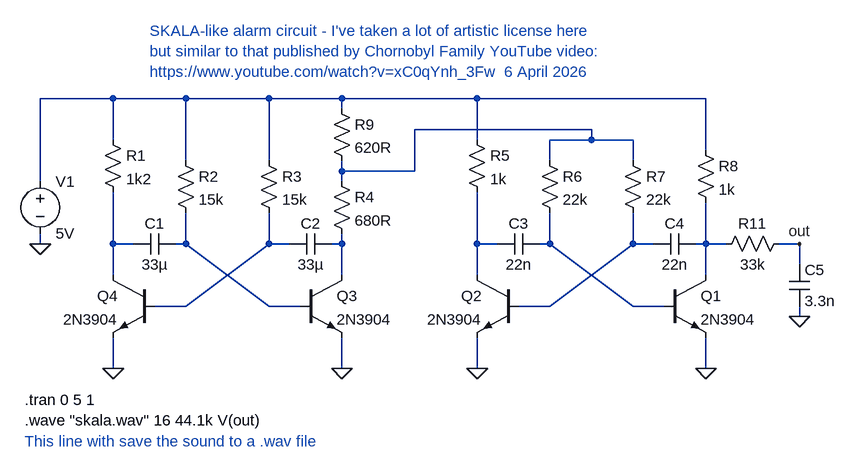
[diagram p0: schematic skala.asc]
skala.asc, the LTspice schematic file:
Version 4.1
SHEET 1 1672 680
WIRE 112 -160 0 -160
WIRE 224 -160 112 -160
WIRE 352 -160 224 -160
WIRE 464 -160 352 -160
WIRE 672 -160 464 -160
WIRE 1024 -160 672 -160
WIRE 464 -144 464 -160
WIRE 848 -112 576 -112
WIRE 112 -96 112 -160
WIRE 672 -96 672 -160
WIRE 848 -96 848 -112
WIRE 848 -96 784 -96
WIRE 912 -96 848 -96
WIRE 1024 -80 1024 -160
WIRE 224 -64 224 -160
WIRE 352 -64 352 -160
WIRE 784 -64 784 -96
WIRE 912 -64 912 -96
WIRE 464 -48 464 -64
WIRE 576 -48 576 -112
WIRE 576 -48 464 -48
WIRE 0 -32 0 -160
WIRE 464 -32 464 -48
WIRE 0 64 0 48
WIRE 112 64 112 -16
WIRE 144 64 112 64
WIRE 224 64 224 16
WIRE 224 64 208 64
WIRE 352 64 352 16
WIRE 384 64 352 64
WIRE 464 64 464 48
WIRE 464 64 448 64
WIRE 672 64 672 -16
WIRE 704 64 672 64
WIRE 784 64 784 16
WIRE 784 64 768 64
WIRE 912 64 912 16
WIRE 944 64 912 64
WIRE 1024 64 1024 0
WIRE 1024 64 1008 64
WIRE 1056 64 1024 64
WIRE 1168 64 1136 64
WIRE 1168 96 1168 64
WIRE 112 112 112 64
WIRE 464 112 464 64
WIRE 672 112 672 64
WIRE 1024 112 1024 64
WIRE 224 160 352 64
WIRE 224 160 176 160
WIRE 352 160 224 64
WIRE 400 160 352 160
WIRE 784 160 912 64
WIRE 784 160 736 160
WIRE 912 160 784 64
WIRE 960 160 912 160
WIRE 1168 176 1168 160
WIRE 112 256 112 208
WIRE 464 256 464 208
WIRE 672 256 672 208
WIRE 1024 256 1024 208
FLAG 112 256 0
FLAG 464 256 0
FLAG 0 64 0
FLAG 1168 64 out
FLAG 672 256 0
FLAG 1168 176 0
FLAG 1024 256 0
SYMBOL res 96 -112 R0
SYMATTR InstName R1
SYMATTR Value 1k2
SYMBOL res 208 -80 R0
SYMATTR InstName R2
SYMATTR Value 15k
SYMBOL res 336 -80 R0
SYMATTR InstName R3
SYMATTR Value 15k
SYMBOL res 448 -48 R0
SYMATTR InstName R4
SYMATTR Value 680R
SYMBOL cap 208 48 R90
WINDOW 0 0 32 VBottom 2
WINDOW 3 32 32 VTop 2
SYMATTR InstName C1
SYMATTR Value 33µ
SYMBOL cap 448 48 R90
WINDOW 0 0 32 VBottom 2
WINDOW 3 32 32 VTop 2
SYMATTR InstName C2
SYMATTR Value 33µ
SYMBOL voltage 0 -48 R0
WINDOW 123 0 0 Left 0
WINDOW 39 0 0 Left 0
SYMATTR InstName V1
SYMATTR Value 5V
SYMBOL npn 400 112 R0
SYMATTR InstName Q3
SYMATTR Value 2N3904
SYMBOL npn 176 112 M0
SYMATTR InstName Q4
SYMATTR Value 2N3904
SYMBOL res 656 -112 R0
SYMATTR InstName R5
SYMATTR Value 1k
SYMBOL res 768 -80 R0
SYMATTR InstName R6
SYMATTR Value 22k
SYMBOL res 896 -80 R0
SYMATTR InstName R7
SYMATTR Value 22k
SYMBOL res 1008 -96 R0
SYMATTR InstName R8
SYMATTR Value 1k
SYMBOL cap 768 48 R90
WINDOW 0 0 32 VBottom 2
WINDOW 3 32 32 VTop 2
SYMATTR InstName C3
SYMATTR Value 22n
SYMBOL cap 1008 48 R90
WINDOW 0 0 32 VBottom 2
WINDOW 3 32 32 VTop 2
SYMATTR InstName C4
SYMATTR Value 22n
SYMBOL npn 960 112 R0
SYMATTR InstName Q1
SYMATTR Value 2N3904
SYMBOL npn 736 112 M0
SYMATTR InstName Q2
SYMATTR Value 2N3904
SYMBOL res 448 -160 R0
SYMATTR InstName R9
SYMATTR Value 620R
SYMBOL res 1152 48 R90
WINDOW 0 0 56 VBottom 2
WINDOW 3 32 56 VTop 2
SYMATTR InstName R11
SYMATTR Value 33k
SYMBOL cap 1152 96 R0
SYMATTR InstName C5
SYMATTR Value 3.3n
TEXT -24 304 Left 2 !.tran 0 5 1
TEXT -24 336 Left 2 !.wave "skala.wav" 16 44.1k V(out)
TEXT 168 -264 Left 2 ;SKALA-like alarm circuit - I've taken a lot of artistic license here\nbut similar to that published by Chornobyl Family YouTube video:\nhttps://www.youtube.com/watch?v=xC0qYnh_3Fw  6 April 2026
TEXT -24 368 Left 2 ;This line with save the sound to a .wav file

The netlist it stands for:
* skala.asc
R1 N001 N003 1k2
R2 N001 N004 15k
R3 N001 N005 15k
R4 N002 N006 680R
C1 N004 N003 33µ
C2 N006 N005 33µ
V1 N001 0 5V
Q3 N006 N004 0 0 2N3904
Q4 N003 N005 0 0 2N3904
R5 N001 N007 1k
R6 N002 N008 22k
R7 N002 N009 22k
R8 N001 N010 1k
C3 N008 N007 22n
C4 N010 N009 22n
Q1 N010 N008 0 0 2N3904
Q2 N007 N009 0 0 2N3904
R9 N001 N002 620R
R11 out N010 33k
C5 out 0 3.3n
.model NPN NPN
.model PNP PNP
.lib standard.bjt
.tran 0 5 1
.wave "skala.wav" 16 44.1k V(out)
* SKALA-like alarm circuit - I've taken a lot of artistic license here
* but similar to that published by Chornobyl Family YouTube video:
* https://www.youtube.com/watch?v=xC0qYnh_3Fw  6 April 2026
* This line with save the sound to a .wav file
.backanno
.end